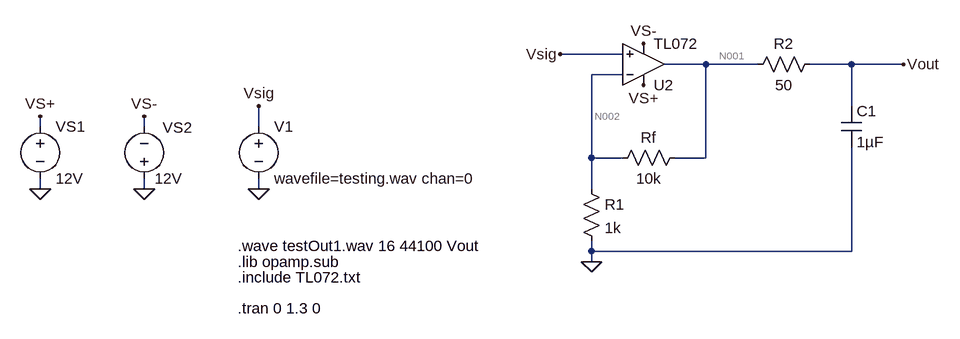
[diagram p0: schematic Simplified.asc]
Simplified.asc, the LTspice schematic file:
Version 4
SHEET 1 1672 680
WIRE 656 -16 560 -16
WIRE 784 0 720 0
WIRE 864 0 784 0
WIRE 1008 0 944 0
WIRE 1088 0 1008 0
WIRE 656 16 608 16
WIRE 1008 64 1008 0
WIRE -240 96 -240 80
WIRE -80 96 -80 80
WIRE 96 96 96 64
WIRE 608 144 608 16
WIRE 656 144 608 144
WIRE 784 144 784 0
WIRE 784 144 736 144
WIRE -240 192 -240 176
WIRE -80 192 -80 176
WIRE 96 192 96 176
WIRE 608 192 608 144
WIRE 608 288 608 272
WIRE 1008 288 1008 128
WIRE 1008 288 608 288
WIRE 608 304 608 288
FLAG 96 192 0
FLAG 96 64 Vsig
FLAG 560 -16 Vsig
FLAG -240 192 0
FLAG -80 192 0
FLAG -240 80 VS+
FLAG -80 80 VS-
FLAG 688 32 VS+
FLAG 688 -32 VS-
FLAG 608 304 0
FLAG 1088 0 Vout
SYMBOL voltage 96 80 R0
WINDOW 123 0 0 Left 0
WINDOW 39 0 0 Left 0
SYMATTR InstName V1
SYMATTR Value wavefile=testing.wav chan=0
SYMBOL voltage -240 80 R0
WINDOW 123 0 0 Left 0
WINDOW 39 0 0 Left 0
SYMATTR InstName VS1
SYMATTR Value 12V
SYMBOL voltage -80 192 R180
WINDOW 123 0 0 Left 0
WINDOW 39 0 0 Left 0
WINDOW 0 -73 95 Left 2
WINDOW 3 -59 16 Left 2
SYMATTR InstName VS2
SYMATTR Value 12V
SYMBOL OpAmps\\opamp2 688 64 M180
SYMATTR InstName U2
SYMATTR Value TL072
SYMBOL res 592 176 R0
SYMATTR InstName R1
SYMATTR Value 1k
SYMBOL res 752 128 R90
WINDOW 0 0 56 VBottom 2
WINDOW 3 32 56 VTop 2
SYMATTR InstName Rf
SYMATTR Value 10k
SYMBOL res 960 -16 R90
WINDOW 0 0 56 VBottom 2
WINDOW 3 32 56 VTop 2
SYMATTR InstName R2
SYMATTR Value 50
SYMBOL cap 992 64 R0
SYMATTR InstName C1
SYMATTR Value 1µF
TEXT 64 280 Left 2 !.wave testOut1.wav 16 44100 Vout
TEXT 64 376 Left 2 !.tran 0 1.3 0
TEXT 64 304 Left 2 !.lib opamp.sub
TEXT 64 328 Left 2 !.include TL072.txt

The netlist it stands for:
* Simplified.asc
V1 Vsig 0 wavefile=testing.wav chan=0
VS1 VS+ 0 12V
VS2 0 VS- 12V
XU2 Vsig N002 VS+ VS- N001 TL072  ; pins In+ In- V+ V- OUT
R1 N002 0 1k
Rf N001 N002 10k
R2 Vout N001 50
C1 Vout 0 1µF
.wave testOut1.wav 16 44100 Vout
.tran 0 1.3 0
.lib opamp.sub
.include TL072.txt
.backanno
.end

* Results of the author's LTspice run, read from the files saved beside the schematic
* Operating Point, zero values left out:
*   V(vsig) = -885 µV
*   V(vs+) = 12 V
*   V(vs-) = -12 V
*   V(vout) = -9.613 mV
*   V(n002) = -874 µV
*   V(n001) = -9.613 mV
*   I(Rf) = -873.9 nA
*   I(R1) = -874 nA
*   I(Vs2) = -11.39 mA
*   I(Vs1) = -11.39 mA
*   I(V1) = -42.05 pA
*   Ix(u2:1) = 42.05 pA
*   Ix(u2:2) = 42.05 pA
*   Ix(u2:3) = 11.39 mA
*   Ix(u2:4) = -11.39 mA
*   Ix(u2:5) = 873.9 nA